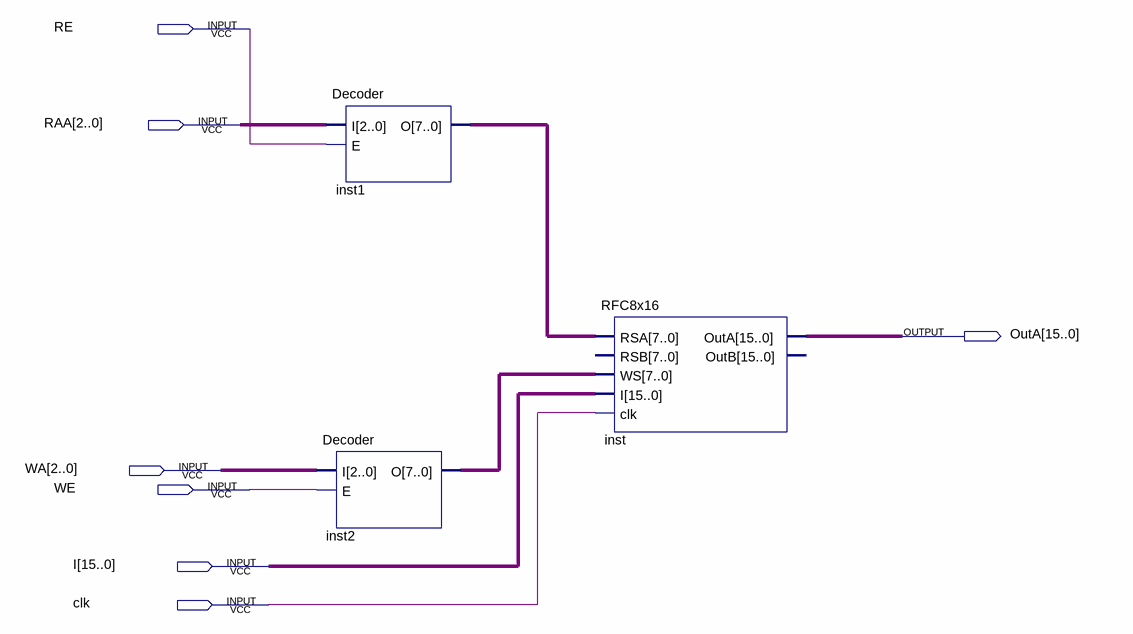
[diagram p0: schematic sheet]
// Quartus schematic REGFILE.bdf as structural Verilog: 3 symbols, 7 pins
module REGFILE (
  input  RE,
  input  [2:0] RAA,
  input  [2:0] WA,
  input  WE,
  input  [15:0] I,
  input  clk,
  output [15:0] OutA
);

  wire [7:0] inst1_o, inst2_o;

  Decoder inst1 (.I(RAA), .E(RE), .O(inst1_o));
  Decoder inst2 (.I(WA), .E(WE), .O(inst2_o));
  RFC8x16 inst (.RSA(inst1_o), .WS(inst2_o), .I(I), .clk(clk), .OutA(OutA));  // open: RSB, OutB
endmodule
